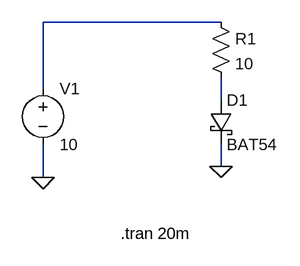
[diagram p0: schematic led.asc]
led.asc, the LTspice schematic file:
Version 4
SHEET 1 880 680
WIRE 384 128 128 128
WIRE 128 224 128 128
WIRE 384 240 384 208
WIRE 384 336 384 304
WIRE 128 352 128 304
FLAG 128 352 0
FLAG 384 336 0
SYMBOL schottky 368 240 R0
SYMATTR InstName D1
SYMATTR Value BAT54
SYMATTR Description Light Emitting Diode
SYMATTR Type led
SYMBOL res 368 112 R0
SYMATTR InstName R1
SYMATTR Value 10
SYMBOL voltage 128 208 R0
SYMATTR InstName V1
SYMATTR Value 10
TEXT 240 432 Left 2 !.tran 20m

The netlist it stands for:
* led.asc
D1 N002 0 BAT54
R1 N001 N002 10
V1 N001 0 10
.model D D
.lib standard.dio
.tran 20m
.backanno
.end